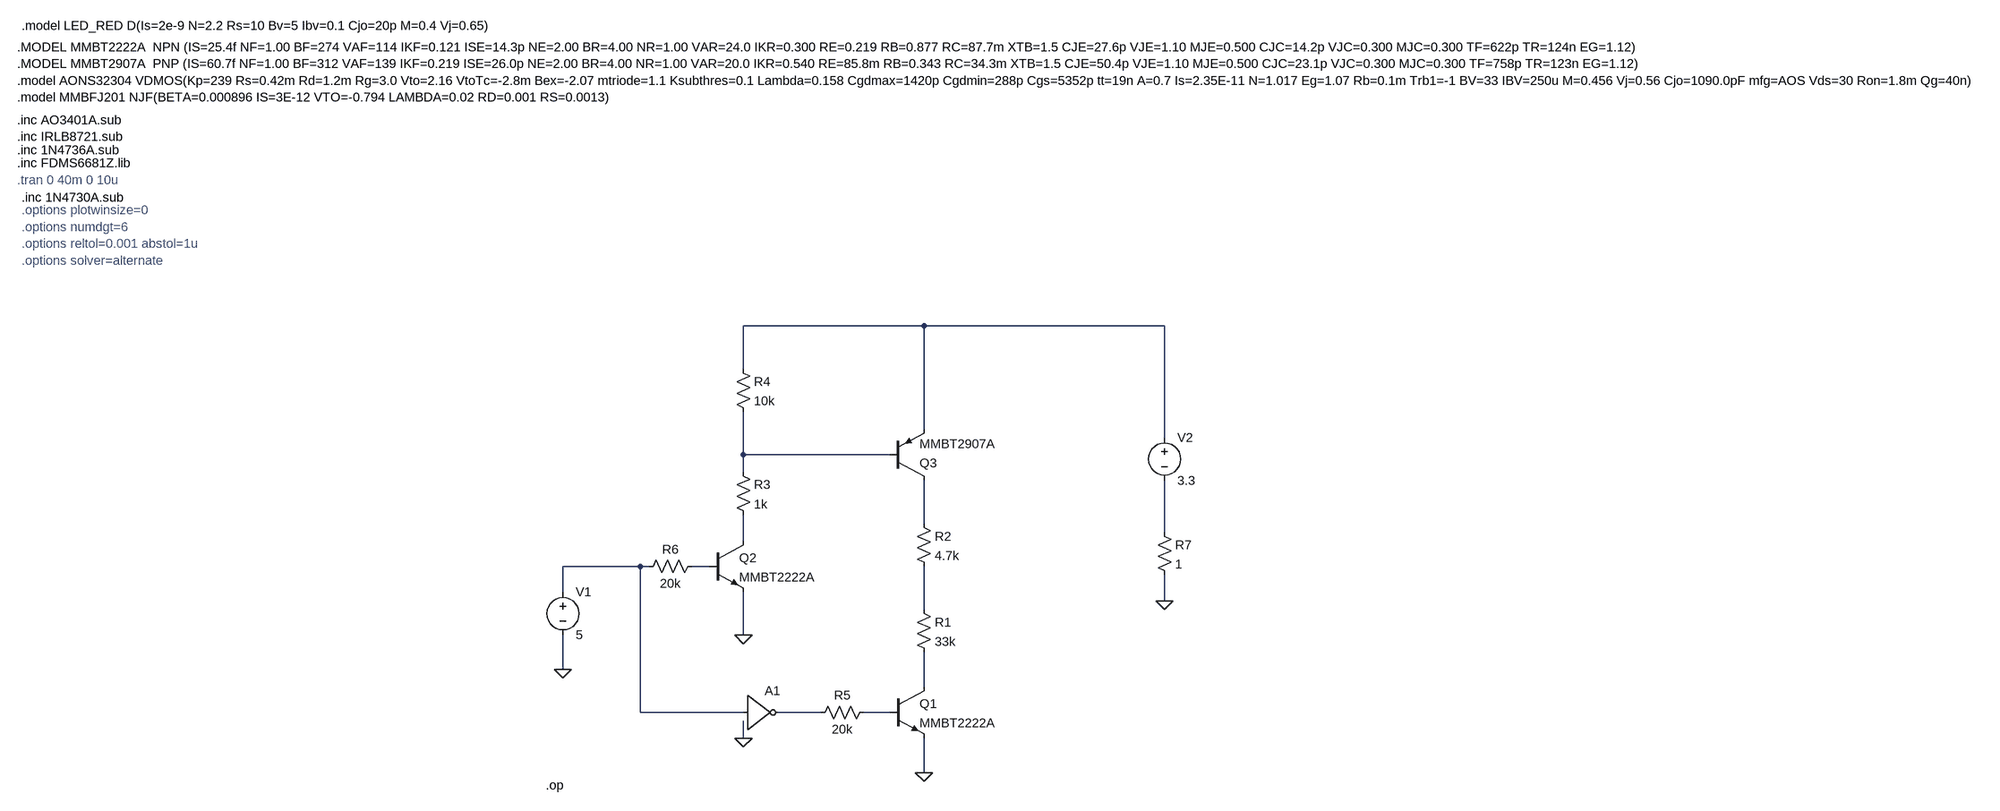
[diagram p0: schematic prueba de driver.asc]
prueba de driver.asc, the LTspice schematic file:
Version 4.1
SHEET 1 2436 680
WIRE 144 -432 -192 -432
WIRE 592 -432 144 -432
WIRE -192 -352 -192 -432
WIRE 144 -240 144 -432
WIRE 592 -224 592 -432
WIRE -192 -192 -192 -272
WIRE 80 -192 -192 -192
WIRE -192 -160 -192 -192
WIRE 144 -64 144 -144
WIRE 592 -48 592 -144
WIRE -192 -32 -192 -80
WIRE -384 16 -528 16
WIRE -368 16 -384 16
WIRE -256 16 -288 16
WIRE -528 64 -528 16
WIRE 592 80 592 32
WIRE 144 96 144 16
WIRE -192 144 -192 64
WIRE -528 208 -528 144
WIRE 144 240 144 176
WIRE -384 288 -384 16
WIRE -192 288 -384 288
WIRE -48 288 -128 288
WIRE 80 288 32 288
WIRE -192 336 -192 304
WIRE 144 400 144 336
FLAG -192 144 0
FLAG 144 400 0
FLAG -192 336 0
FLAG -528 208 0
FLAG 592 80 0
DATAFLAG 144 48 ""
DATAFLAG 0 -192 ""
DATAFLAG -192 -384 "$-V(N002)"
DATAFLAG -384 16 "$-V(N007)"
DATAFLAG 64 288 "$-V(N010)"
SYMBOL npn 80 240 R0
SYMATTR InstName Q1
SYMATTR Value MMBT2222A
SYMBOL res 128 80 R0
SYMATTR InstName R1
SYMATTR Value 33k
SYMBOL res 128 -80 R0
SYMATTR InstName R2
SYMATTR Value 4.7k
SYMBOL npn -256 -32 R0
SYMATTR InstName Q2
SYMATTR Value MMBT2222A
SYMBOL res -208 -176 R0
SYMATTR InstName R3
SYMATTR Value 1k
SYMBOL res -208 -368 R0
SYMATTR InstName R4
SYMATTR Value 10k
SYMBOL res 48 272 R90
WINDOW 0 0 56 VBottom 2
WINDOW 3 32 56 VTop 2
SYMATTR InstName R5
SYMATTR Value 20k
SYMBOL pnp 80 -144 M180
SYMATTR InstName Q3
SYMATTR Value MMBT2907A
SYMBOL res -272 0 R90
WINDOW 0 0 56 VBottom 2
WINDOW 3 32 56 VTop 2
SYMATTR InstName R6
SYMATTR Value 20k
SYMBOL Digital\\inv -192 224 R0
SYMATTR InstName A1
SYMBOL voltage -528 48 R0
WINDOW 123 0 0 Left 0
WINDOW 39 0 0 Left 0
SYMATTR InstName V1
SYMATTR Value 5
SYMBOL voltage 592 -240 R0
WINDOW 123 0 0 Left 0
WINDOW 39 0 0 Left 0
SYMATTR InstName V2
SYMATTR Value 3.3
SYMBOL res 576 -64 R0
SYMATTR InstName R7
SYMATTR Value 1
TEXT -560 424 Left 2 !.op
TEXT -1544 -792 Left 2 ;.tran 0 40m 0 10u
TEXT -1544 -1040 Left 2 !.MODEL MMBT2222A  NPN (IS=25.4f NF=1.00 BF=274 VAF=114 IKF=0.121 ISE=14.3p NE=2.00 BR=4.00 NR=1.00 VAR=24.0 IKR=0.300 RE=0.219 RB=0.877 RC=87.7m XTB=1.5 CJE=27.6p VJE=1.10 MJE=0.500 CJC=14.2p VJC=0.300 MJC=0.300 TF=622p TR=124n EG=1.12)\n.MODEL MMBT2907A  PNP (IS=60.7f NF=1.00 BF=312 VAF=139 IKF=0.219 ISE=26.0p NE=2.00 BR=4.00 NR=1.00 VAR=20.0 IKR=0.540 RE=85.8m RB=0.343 RC=34.3m XTB=1.5 CJE=50.4p VJE=1.10 MJE=0.500 CJC=23.1p VJC=0.300 MJC=0.300 TF=758p TR=123n EG=1.12)\n.model AONS32304 VDMOS(Kp=239 Rs=0.42m Rd=1.2m Rg=3.0 Vto=2.16 VtoTc=-2.8m Bex=-2.07 mtriode=1.1 Ksubthres=0.1 Lambda=0.158 Cgdmax=1420p Cgdmin=288p Cgs=5352p tt=19n A=0.7 Is=2.35E-11 N=1.017 Eg=1.07 Rb=0.1m Trb1=-1 BV=33 IBV=250u M=0.456 Vj=0.56 Cjo=1090.0pF mfg=AOS Vds=30 Ron=1.8m Qg=40n)\n.model MMBFJ201 NJF(BETA=0.000896 IS=3E-12 VTO=-0.794 LAMBDA=0.02 RD=0.001 RS=0.0013)
TEXT -1544 -904 Left 2 !.inc AO3401A.sub\n.inc IRLB8721.sub
TEXT -1544 -848 Left 2 !.inc 1N4736A.sub
TEXT -1536 -736 Left 2 ;.options plotwinsize=0\n.options numdgt=6\n.options reltol=0.001 abstol=1u\n.options solver=alternate
TEXT -1544 -824 Left 2 !.inc FDMS6681Z.lib
TEXT -1536 -760 Left 2 !.inc 1N4730A.sub
TEXT -1536 -1080 Left 2 !.model LED_RED D(Is=2e-9 N=2.2 Rs=10 Bv=5 Ibv=0.1 Cjo=20p M=0.4 Vj=0.65)

The netlist it stands for:
* prueba de driver.asc
Q1 N009 N011 0 0 MMBT2222A
R1 N008 N009 33k
R2 N003 N008 4.7k
Q2 N005 N007 0 0 MMBT2222A
R3 N002 N005 1k
R4 N001 N002 10k
R5 N011 N010 20k
Q3 N003 N002 N001 0 MMBT2907A
R6 N007 N006 20k
A1 N006 0 0 0 0 N010 0 0 BUF
V1 N006 0 5
V2 N001 N004 3.3
R7 N004 0 1
.model NPN NPN
.model PNP PNP
.lib standard.bjt
.op
* .tran 0 40m 0 10u
.MODEL MMBT2222A  NPN (IS=25.4f NF=1.00 BF=274 VAF=114 IKF=0.121 ISE=14.3p NE=2.00 BR=4.00 NR=1.00 VAR=24.0 IKR=0.300 RE=0.219 RB=0.877 RC=87.7m XTB=1.5 CJE=27.6p VJE=1.10 MJE=0.500 CJC=14.2p VJC=0.300 MJC=0.300 TF=622p TR=124n EG=1.12)
.MODEL MMBT2907A  PNP (IS=60.7f NF=1.00 BF=312 VAF=139 IKF=0.219 ISE=26.0p NE=2.00 BR=4.00 NR=1.00 VAR=20.0 IKR=0.540 RE=85.8m RB=0.343 RC=34.3m XTB=1.5 CJE=50.4p VJE=1.10 MJE=0.500 CJC=23.1p VJC=0.300 MJC=0.300 TF=758p TR=123n EG=1.12)
.model AONS32304 VDMOS(Kp=239 Rs=0.42m Rd=1.2m Rg=3.0 Vto=2.16 VtoTc=-2.8m Bex=-2.07 mtriode=1.1 Ksubthres=0.1 Lambda=0.158 Cgdmax=1420p Cgdmin=288p Cgs=5352p tt=19n A=0.7 Is=2.35E-11 N=1.017 Eg=1.07 Rb=0.1m Trb1=-1 BV=33 IBV=250u M=0.456 Vj=0.56 Cjo=1090.0pF mfg=AOS Vds=30 Ron=1.8m Qg=40n)
.model MMBFJ201 NJF(BETA=0.000896 IS=3E-12 VTO=-0.794 LAMBDA=0.02 RD=0.001 RS=0.0013)
.inc AO3401A.sub
.inc IRLB8721.sub
.inc 1N4736A.sub
* .options plotwinsize=0
* .options numdgt=6
* .options reltol=0.001 abstol=1u
* .options solver=alternate
.inc FDMS6681Z.lib
.inc 1N4730A.sub
.model LED_RED D(Is=2e-9 N=2.2 Rs=10 Bv=5 Ibv=0.1 Cjo=20p M=0.4 Vj=0.65)
.backanno
.end